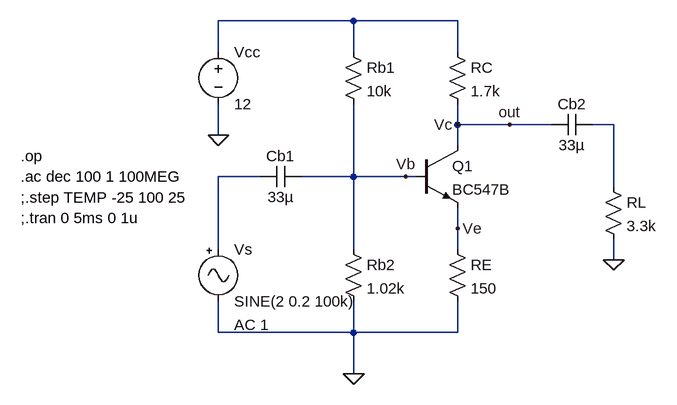
[diagram p0: schematic Lab00.asc]
Lab00.asc, the LTspice schematic file:
Version 4
SHEET 1 880 680
WIRE -80 -16 -288 -16
WIRE 80 -16 -80 -16
WIRE -288 32 -288 -16
WIRE -80 32 -80 -16
WIRE 80 32 80 -16
WIRE 80 144 80 112
WIRE 160 144 80 144
WIRE 224 144 160 144
WIRE 320 144 288 144
WIRE -288 160 -288 112
WIRE 80 176 80 144
WIRE -224 224 -288 224
WIRE -80 224 -80 112
WIRE -80 224 -160 224
WIRE 0 224 -80 224
WIRE 16 224 0 224
WIRE 320 240 320 144
WIRE 80 304 80 272
WIRE -288 336 -288 224
WIRE -80 336 -80 224
WIRE 80 336 80 304
WIRE 320 352 320 320
WIRE -288 464 -288 416
WIRE -80 464 -80 416
WIRE -80 464 -288 464
WIRE 80 464 80 416
WIRE 80 464 -80 464
WIRE -80 528 -80 464
FLAG -80 528 0
FLAG 80 144 Vc
FLAG 80 304 Ve
FLAG 0 224 Vb
FLAG -288 160 0
FLAG 320 352 0
FLAG 160 144 out
SYMBOL npn 16 176 R0
SYMATTR InstName Q1
SYMATTR Value BC547B
SYMBOL res 64 16 R0
SYMATTR InstName RC
SYMATTR Value 1.7k
SYMBOL res 64 320 R0
SYMATTR InstName RE
SYMATTR Value 150
SYMBOL res -96 320 R0
SYMATTR InstName Rb2
SYMATTR Value 1.02k
SYMBOL res -96 16 R0
SYMATTR InstName Rb1
SYMATTR Value 10k
SYMBOL cap -160 208 R90
WINDOW 0 0 32 VBottom 2
WINDOW 3 32 32 VTop 2
SYMATTR InstName Cb1
SYMATTR Value 33µ
SYMBOL Misc\\signal -288 320 R0
WINDOW 123 24 132 Left 2
WINDOW 39 0 0 Left 0
SYMATTR Value2 AC 1
SYMATTR InstName Vs
SYMATTR Value SINE(2 0.2 100k)
SYMBOL voltage -288 16 R0
WINDOW 123 0 0 Left 0
WINDOW 39 0 0 Left 0
SYMATTR InstName Vcc
SYMATTR Value 12
SYMBOL cap 288 128 R90
WINDOW 0 0 32 VBottom 2
WINDOW 3 32 32 VTop 2
SYMATTR InstName Cb2
SYMATTR Value 33µ
SYMBOL res 304 224 R0
SYMATTR InstName RL
SYMATTR Value 3.3k
TEXT -592 192 Left 2 !.op
TEXT -592 224 Left 2 !.ac dec 100 1 100MEG
TEXT -592 256 Left 2 !;.step TEMP -25 100 25
TEXT -592 288 Left 2 !;.tran 0 5ms 0 1u

The netlist it stands for:
* Lab00.asc
Q1 out Vb Ve 0 BC547B
RC N001 out 1.7k
RE Ve 0 150
Rb2 Vb 0 1.02k
Rb1 N001 Vb 10k
Cb1 Vb N003 33µ
Vs N003 0 SINE(2 0.2 100k) AC 1
Vcc N001 0 12
Cb2 N002 out 33µ
RL N002 0 3.3k
.model NPN NPN
.model PNP PNP
.lib standard.bjt
.op
.ac dec 100 1 100MEG
;.step TEMP -25 100 25
;.tran 0 5ms 0 1u
.backanno
.end